# EAGLE design explorator_mainboard_v2_58mm_1_1 (EAGLE 9.6.2)
CNAME: Parrot Teensy Board; CREVISION: 1.0; DESIGNER: Nathan Villicana-Shaw

## Sheet 1 of 2
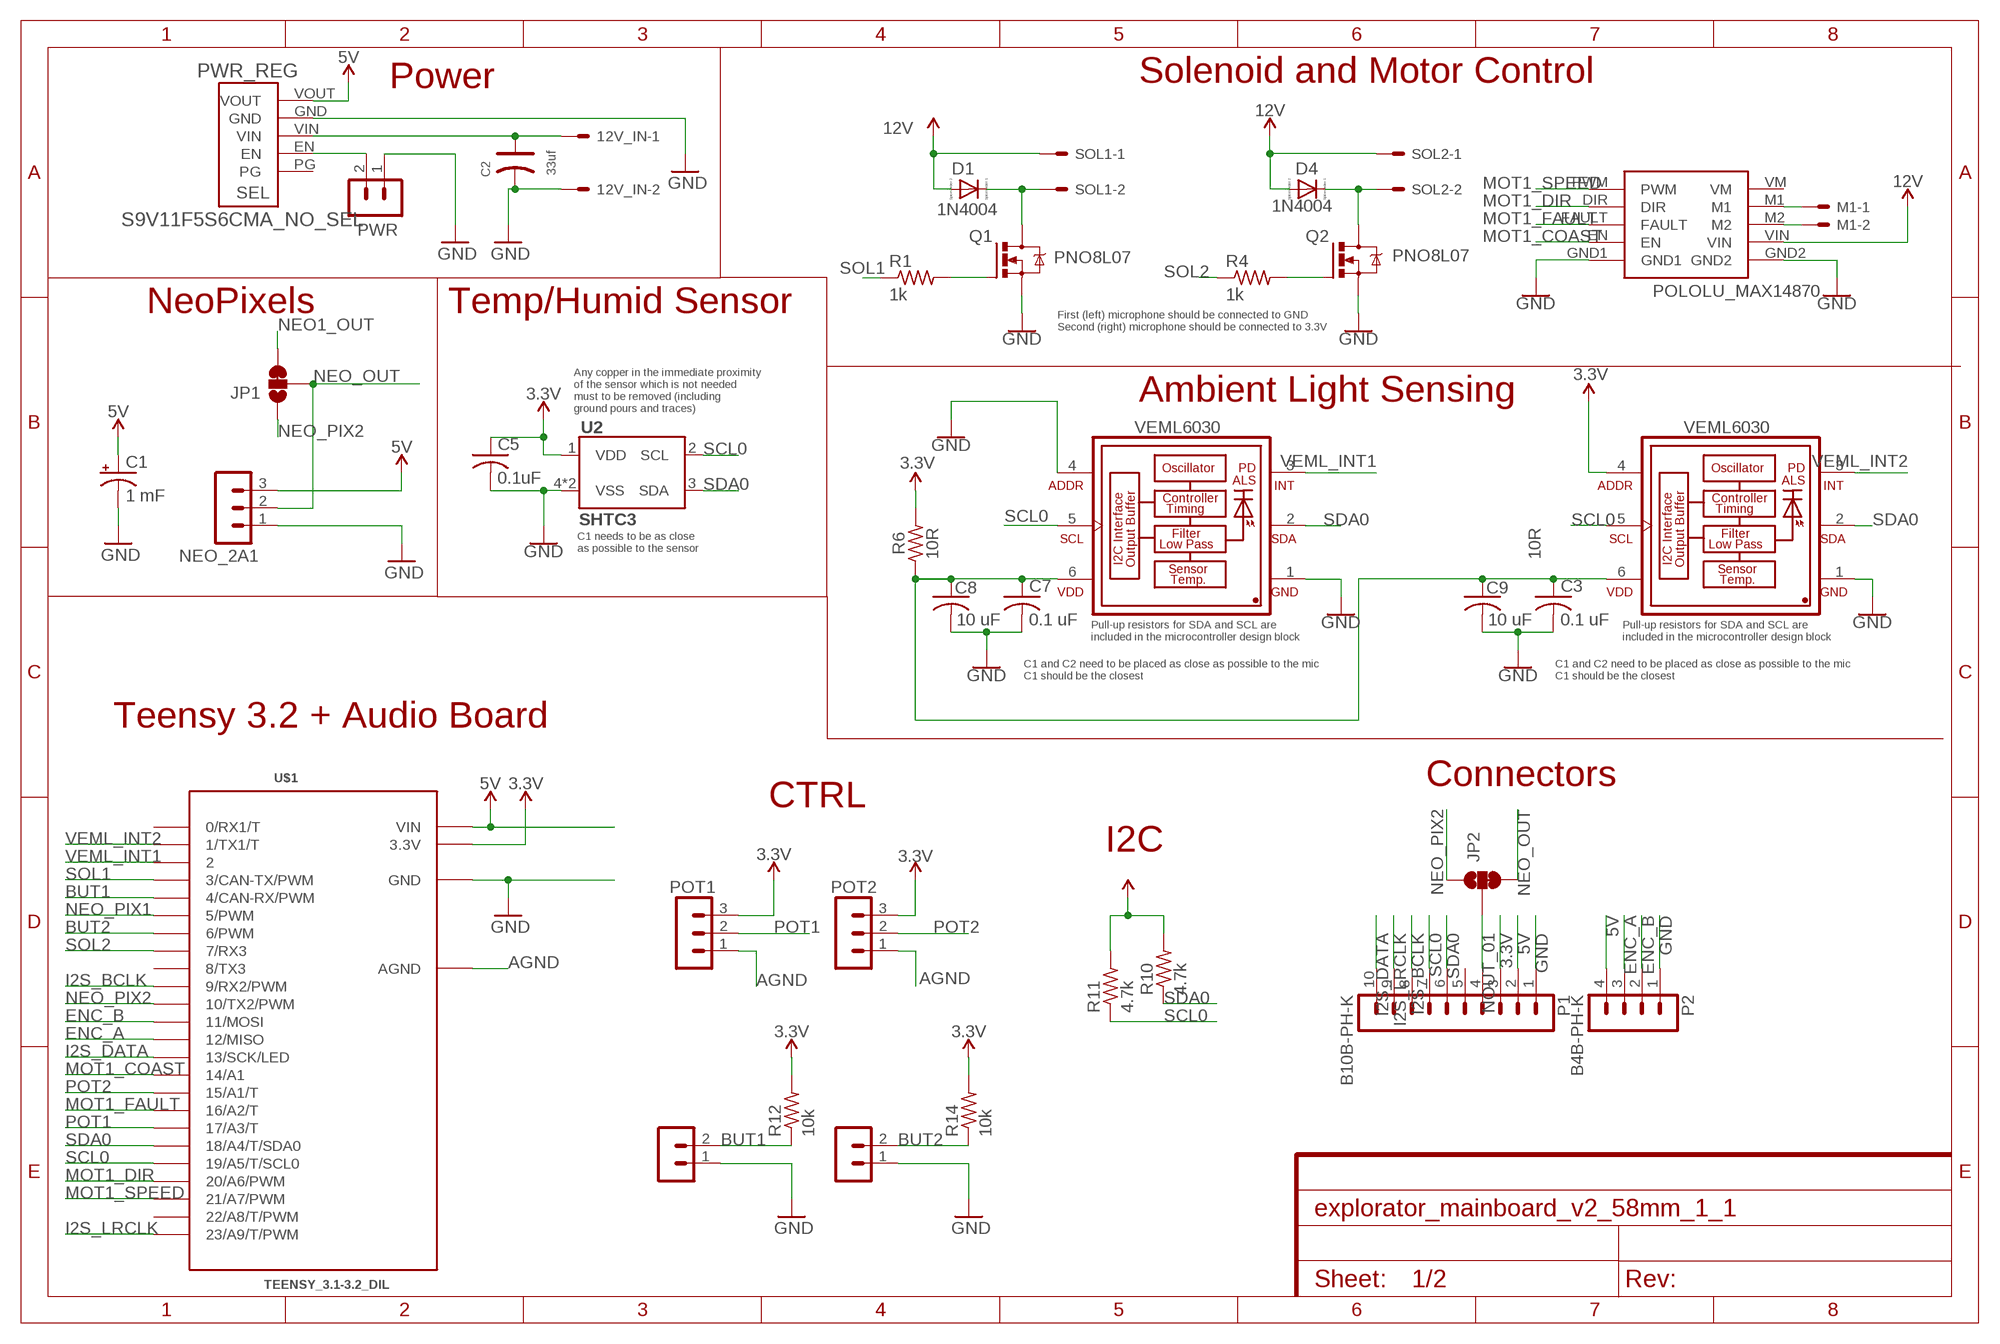
[diagram p0: schematic, sheet 1]

### Parts
12V_IN  5566-2  [5566-2]
BUT1  B2B-PH-K  [B2B-PH-K]
BUT2  B2B-PH-K  [B2B-PH-K]
C1  1 mF  CPOL-USUD-10X10  [UD-10X10_NICHICON]
C2  33uf  DIP-ALUMINUM-47UF-16V(D5-H7MM)  [PC-D5.3MM]
C3  0.1 uF  C-USC0805  [C0805]
C5  0.1uF  C-USC0805  [C0805]
C7  0.1 uF  C-USC0805  [C0805]
C8  10 uF  C-USC0805  [C0805]
C9  10 uF  C-USC0805  [C0805]
D1  1N4004  DIODE_E-DO35-7  [DIODE_DO35-7]
D4  1N4004  DIODE_E-DO35-7  [DIODE_DO35-7]
JP1  JUMPER-SMT_3_1-NC_TRACE_SILK  [SMT-JUMPER_3_1-NC_TRACE_SILK]
JP2  JUMPER-SMT_3_1-NC_TRACE_SILK  [SMT-JUMPER_3_1-NC_TRACE_SILK]
M1  5566-2  [5566-2]
MOT1  POLOLU_MAX14870  [POLOLU_MAX14870]
NEO_2A1  B3B-PH-K  [B3B-PH-K]
P1  B10B-PH-K  [B10B-PH-K]
P2  B4B-PH-K  [B4B-PH-K]
POT1  B3B-PH-K  [B3B-PH-K]
POT2  B3B-PH-K  [B3B-PH-K]
PWR  B2B-PH-K  [B2B-PH-K]
PWR_REG  S9V11F5S6CMA_NO_SEL  [S9V11F3S5CMA_NO_SEL]
Q1  PNO8L07  IRF540  [TO220BV]
Q2  PNO8L07  IRF540  [TO220BV]
R1  1k  R-US_R0805  [R0805]
R4  1k  R-US_R0805  [R0805]
R6  10 R  R-US_R0805  [R0805]
R10  4.7k  R-US_R0805  [R0805]
R11  4.7k  R-US_R0805  [R0805]
R12  10k  R-US_R0805  [R0805]
R14  10k  R-US_R0805  [R0805]
SOL1  5566-2  [5566-2]
SOL2  5566-2  [5566-2]
U2  SHTC3  [SHTC3]
U$1  TEENSY_3.1-3.2_DIL  [TEENSY_3.0-3.2&LC_DIL]
VMEL1  VEML6030  VEML6030-GS15  [VISHAY_VEML6030_2X2X0.87]
VMEL2  VEML6030  VEML6030-GS15  [VISHAY_VEML6030_2X2X0.87]

### Nets
3.3V [3.3V]: C5.1 P1.3 POT1.3 POT2.3 R6.2 R10.2 R11.2 R12.2 R14.2 U2.1(VDD) U$1.3.3V VMEL2.4(ADDR)
5V: C1.+ NEO_2A1.3 P1.2 P2.4 PWR_REG.VOUT U$1.VIN ; also sheet 2
12V [12V_IN]: 12V_IN.1 C2.+ D1.A(C) D4.A(C) MOT1.VIN PWR_REG.VIN SOL1.1 SOL2.1
AGND: POT1.1 POT2.1 U$1.AGND
BUT1: BUT1.2 R12.1 U$1.4(4/CAN-RX/PWM)
BUT2: BUT2.2 R14.1 U$1.6(6/PWM)
ENC_A: P2.3 U$1.12(12/MISO)
ENC_B: P2.2 U$1.11(11/MOSI)
GND: 12V_IN.2 BUT1.1 BUT2.1 C1.- C2.- C3.2 C5.2 C7.2 C8.2 C9.2 MOT1.GND1 MOT1.GND2 NEO_2A1.1 P1.1 P2.1 PWR.1 PWR_REG.GND Q1.S Q2.S U2.4(VSS) U2.5(VSS) U$1.GND VMEL1.1(GND) VMEL1.4(ADDR) VMEL2.1(GND) ; also sheet 2
I2S_BCLK: P1.8 U$1.9(9/RX2/PWM)
I2S_DATA: P1.10 U$1.13(13/SCK/LED)
I2S_LRCLK: P1.9 U$1.23/A9(23/A9/T/PWM)
MOT1_COAST: MOT1.EN U$1.14/A0(14/A1)
MOT1_DIR: MOT1.DIR U$1.20/A6(20/A6/PWM)
MOT1_FAULT: MOT1.FAULT U$1.16/A2(16/A2/T)
MOT1_SPEED: MOT1.PWM U$1.21/A7(21/A7/PWM)
N$1: M1.2 MOT1.M2
N$2: M1.1 MOT1.M1
N$7: C3.1 C7.1 C8.1 C9.1 R6.1 VMEL1.6(VDD) VMEL2.6(VDD)
N$10: PWR.2 PWR_REG.EN
N$13: Q2.G R4.2
N$14: D4.C(A) Q2.D SOL2.2
N$24: Q1.G R1.2
N$25: D1.C(A) Q1.D SOL1.2
NEO1_OUT: JP1.3 ; also sheet 2
NEO_OUT: JP1.2 JP2.3 NEO_2A1.2
NEO_PIX1: U$1.5(5/PWM) ; also sheet 2
NEO_PIX2: JP1.1 JP2.1 U$1.10(10/TX2/PWM)
NOUT_01: JP2.2 P1.4
POT1: POT1.2 U$1.17/A3(17/A3/T)
POT2: POT2.2 U$1.15/A1(15/A1/T)
SCL0: P1.7 R11.1 U2.2(SCL) U$1.19/A5(19/A5/T/SCL0) VMEL1.5(SCL) VMEL2.5(SCL)
SDA0: P1.6 R10.1 U2.3(SDA) U$1.18/A4(18/A4/T/SDA0) VMEL1.2(SDA) VMEL2.2(SDA)
SOL1: R1.1 U$1.3(3/CAN-TX/PWM)
SOL2: R4.1 U$1.7(7/RX3)
VEML_INT1: U$1.2 VMEL1.3(INT)
VEML_INT2: U$1.1(1/TX1/T) VMEL2.3(INT)
Unconnected: MOT1.VM P1.5 PWR_REG.PG U$1.0(0/RX1/T) U$1.8(8/TX3) U$1.22/A8(22/A8/T/PWM)

### Notes on the sheet
- Power | Solenoid and Motor Control
- NeoPixels | Temp/Humid Sensor
- First (left) microphone should be connected to GND
  Second (right) microphone should be connected to 3.3V
- Ambient Light Sensing
- Any copper in the immediate proximity 
  of the sensor which is not needed
  must to be removed (including 
  ground pours and traces)
- C1 needs to be as close
  as possible to the sensor
- 10R | 10R
- Pull-up resistors for SDA and SCL are 
  included in the microcontroller design block
- Pull-up resistors for SDA and SCL are 
  included in the microcontroller design block
- C1 and C2 need to be placed as close as possible to the mic
  C1 should be the closest
- C1 and C2 need to be placed as close as possible to the mic
  C1 should be the closest
- Teensy 3.2 + Audio Board
- Connectors
- CTRL
- I2C

## Sheet 2 of 2
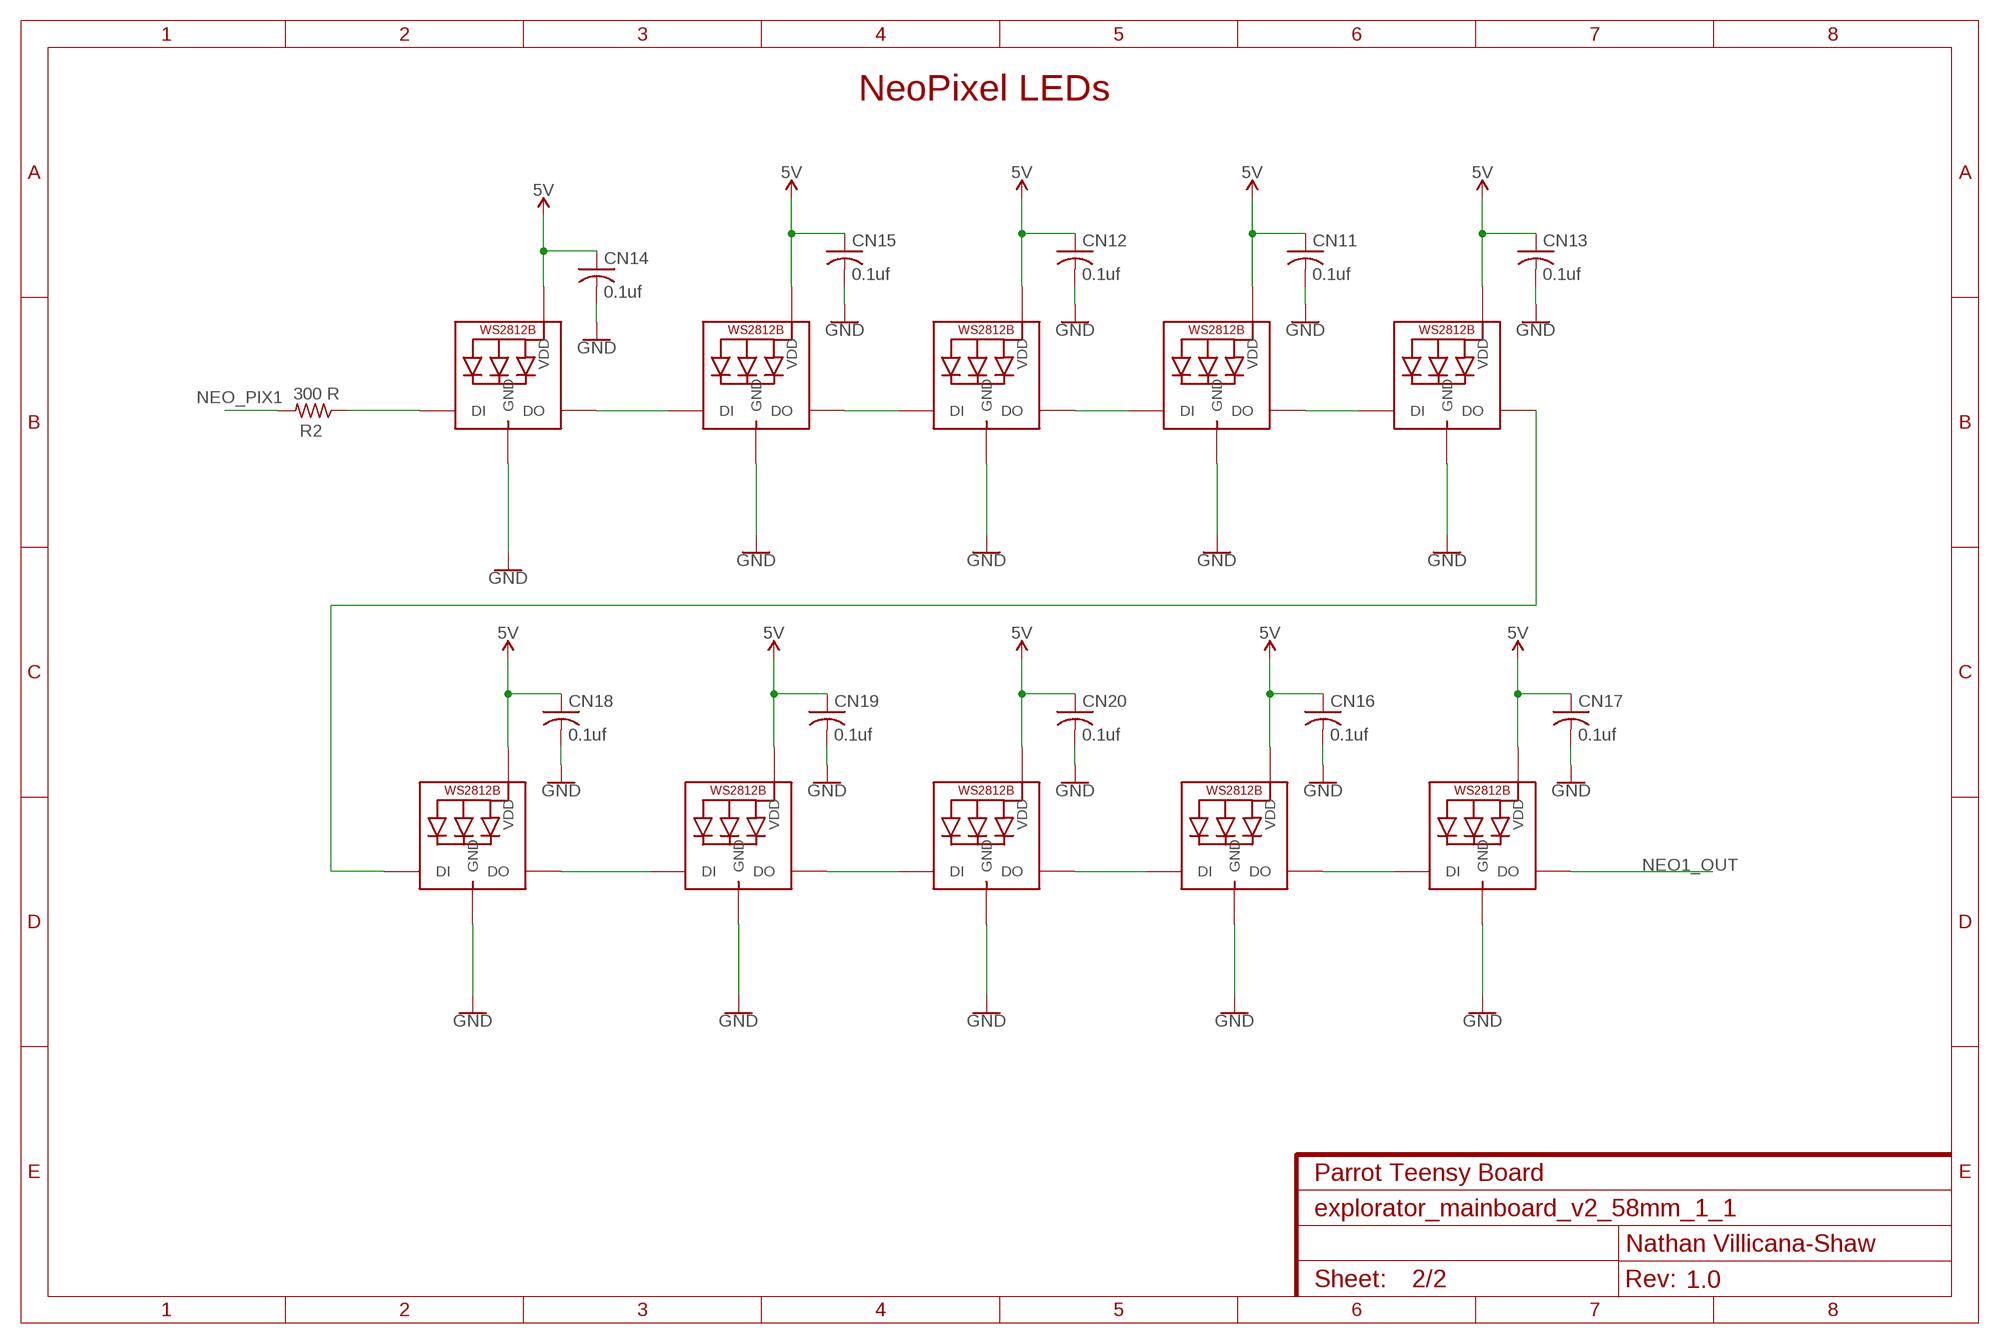
[diagram p1: schematic, sheet 2]

### Parts
CN11  0.1uf  C-USC0805K  [C0805K]
CN12  0.1uf  C-USC0805K  [C0805K]
CN13  0.1uf  C-USC0805K  [C0805K]
CN14  0.1uf  C-USC0805K  [C0805K]
CN15  0.1uf  C-USC0805K  [C0805K]
CN16  0.1uf  C-USC0805K  [C0805K]
CN17  0.1uf  C-USC0805K  [C0805K]
CN18  0.1uf  C-USC0805K  [C0805K]
CN19  0.1uf  C-USC0805K  [C0805K]
CN20  0.1uf  C-USC0805K  [C0805K]
NEO11  WS2812B5050  [WS2812B]
NEO12  WS2812B5050  [WS2812B]
NEO13  WS2812B5050  [WS2812B]
NEO14  WS2812B5050  [WS2812B]
NEO15  WS2812B5050  [WS2812B]
NEO16  WS2812B5050  [WS2812B]
NEO17  WS2812B5050  [WS2812B]
NEO18  WS2812B5050  [WS2812B]
NEO19  WS2812B5050  [WS2812B]
NEO20  WS2812B5050  [WS2812B]
R2  300 R  R-US_R0805  [R0805]

### Nets
5V: CN11.1 CN12.1 CN13.1 CN14.1 CN15.1 CN16.1 CN17.1 CN18.1 CN19.1 CN20.1 NEO11.1-VDD(VDD) NEO12.1-VDD(VDD) NEO13.1-VDD(VDD) NEO14.1-VDD(VDD) NEO15.1-VDD(VDD) NEO16.1-VDD(VDD) NEO17.1-VDD(VDD) NEO18.1-VDD(VDD) NEO19.1-VDD(VDD) NEO20.1-VDD(VDD) ; also sheet 1
GND: CN11.2 CN12.2 CN13.2 CN14.2 CN15.2 CN16.2 CN17.2 CN18.2 CN19.2 CN20.2 NEO11.3-GND(GND) NEO12.3-GND(GND) NEO13.3-GND(GND) NEO14.3-GND(GND) NEO15.3-GND(GND) NEO16.3-GND(GND) NEO17.3-GND(GND) NEO18.3-GND(GND) NEO19.3-GND(GND) NEO20.3-GND(GND) ; also sheet 1
N$17: NEO14.2-DOUT(DO) NEO15.4-DIN(DI)
N$18: NEO12.4-DIN(DI) NEO15.2-DOUT(DO)
N$19: NEO11.4-DIN(DI) NEO12.2-DOUT(DO)
N$20: NEO11.2-DOUT(DO) NEO13.4-DIN(DI)
N$21: NEO13.2-DOUT(DO) NEO18.4-DIN(DI)
N$22: NEO14.4-DIN(DI) R2.1
N$23: NEO18.2-DOUT(DO) NEO19.4-DIN(DI)
N$26: NEO19.2-DOUT(DO) NEO20.4-DIN(DI)
N$27: NEO16.4-DIN(DI) NEO20.2-DOUT(DO)
N$28: NEO16.2-DOUT(DO) NEO17.4-DIN(DI)
NEO1_OUT: NEO17.2-DOUT(DO) ; also sheet 1
NEO_PIX1: R2.2 ; also sheet 1

### Notes on the sheet
- NeoPixel LEDs

## Library data of the parts
12V_IN M1 SOL1 SOL2 = con-molex:5566-2: Mini FIT connector 2 pol Source: http://www.molex.com; MF: MOLEX; OC_FARNELL: 1822072; OC_NEWARK: unknown
BUT1 BUT2 PWR = con-jst-ph:B2B-PH-K: HEADER
C1 = rcl:CPOL-US: POLARIZED CAPACITOR, American symbol; SPICEPREFIX: C
C2 = Seeed-Capacitor:DIP-ALUMINUM-47UF-16V(D5-H7MM): 302030033; MPN: KS 100uF/16V; VALUE: 100uf
C3 C5 C7-C9 = rcl:C-US: CAPACITOR, American symbol; SPICEPREFIX: C
CN11-CN20 = resistor:C-US: CAPACITOR, American symbol
D1 D4 = eagle-ltspice:DIODE_E-: Schottky Diode; SPICEMODEL: diode; SPICEPREFIX: D
JP1 JP2 = SparkFun-Jumpers:JUMPER-SMT_3_1-NC_TRACE: Normally closed trace jumper (1 of 2 connections) This jumper has a trace between two pads so it's normally closed (NC). The other connection is normally open (NO). Use a razor knife to open the connection. For best results follow the IPC guidelines for cutting traces: Cutout at least 0.063 mm (0.005 in). Remove all loose material to clean up the cut area. Seal the cut with an approved epoxy. Reapply solder to reclose the connection, or to close the NO connection.
MOT1 = nathans-custom-parts:POLOLU_MAX14870
NEO11-NEO20 = nathans-custom-parts:WS2812B
NEO_2A1 POT1 POT2 = con-jst-ph:B3B-PH-K: HEADER
P1 = con-jst-ph:B10B-PH-K: HEADER
P2 = con-jst-ph:B4B-PH-K: HEADER
PWR_REG = nathans-custom-parts:S9V11F5S6CMA_NO_SEL
Q1 Q2 = nathans-custom-parts:IRF540: HEXFET Power MOSFET
R1 R4 R10-R12 R14 = rcl:R-US_: RESISTOR, American symbol; SPICEPREFIX: R
R2 R6 = audio amplifier example:R-US_: RESISTOR, American symbol
U2 = SHTC3:SHTC3
U$1 = Teensy_3_and_LC_Series_Boards_v1.4:TEENSY_3.1-3.2_DIL: Teensy 3.1 or 3.2 in a DIL Layout.
VMEL1 VMEL2 = VEML6030-GS15:VEML6030-GS15: VEML6030 High Accuracy Ambient Light Sensor with I2C Interface: VEML6030 is a high accuracy ambient light digital 16-bit resolution sensor in a miniature transparent 2 mm x 2 mm package. It includes a high sensitive photodiode, a low noise amplifier, a 16-bit A/D converter and supports an easy to use I2C bus communication interface and additional interrupt feature. The ambient light result is as digital value available. Device Model created 15.06.2016 by Johannes Kolb - Vishay Semiconductor GmbH; AVAILABILITY: Unavailable; DESCRIPTION: Optical Sensor Ambient 550nm I²C 6-SMD, No Lead; MF: Vishay Semiconductor; MP: VEML6030-GS15; PACKAGE: SMD-6 Vishay; PRICE: None

## Net classes
0 default: width 0.203 mm, drill 0.254 mm, clearance 0.178 mm
1 12V_IN: width 1.016 mm, drill 0.381 mm, clearance 0.203 mm
2 3.3V: width 0.305 mm, drill 0.305 mm, clearance 0.203 mm
3 5V: width 0.635 mm, drill 0.305 mm, clearance 0.203 mm

## Board
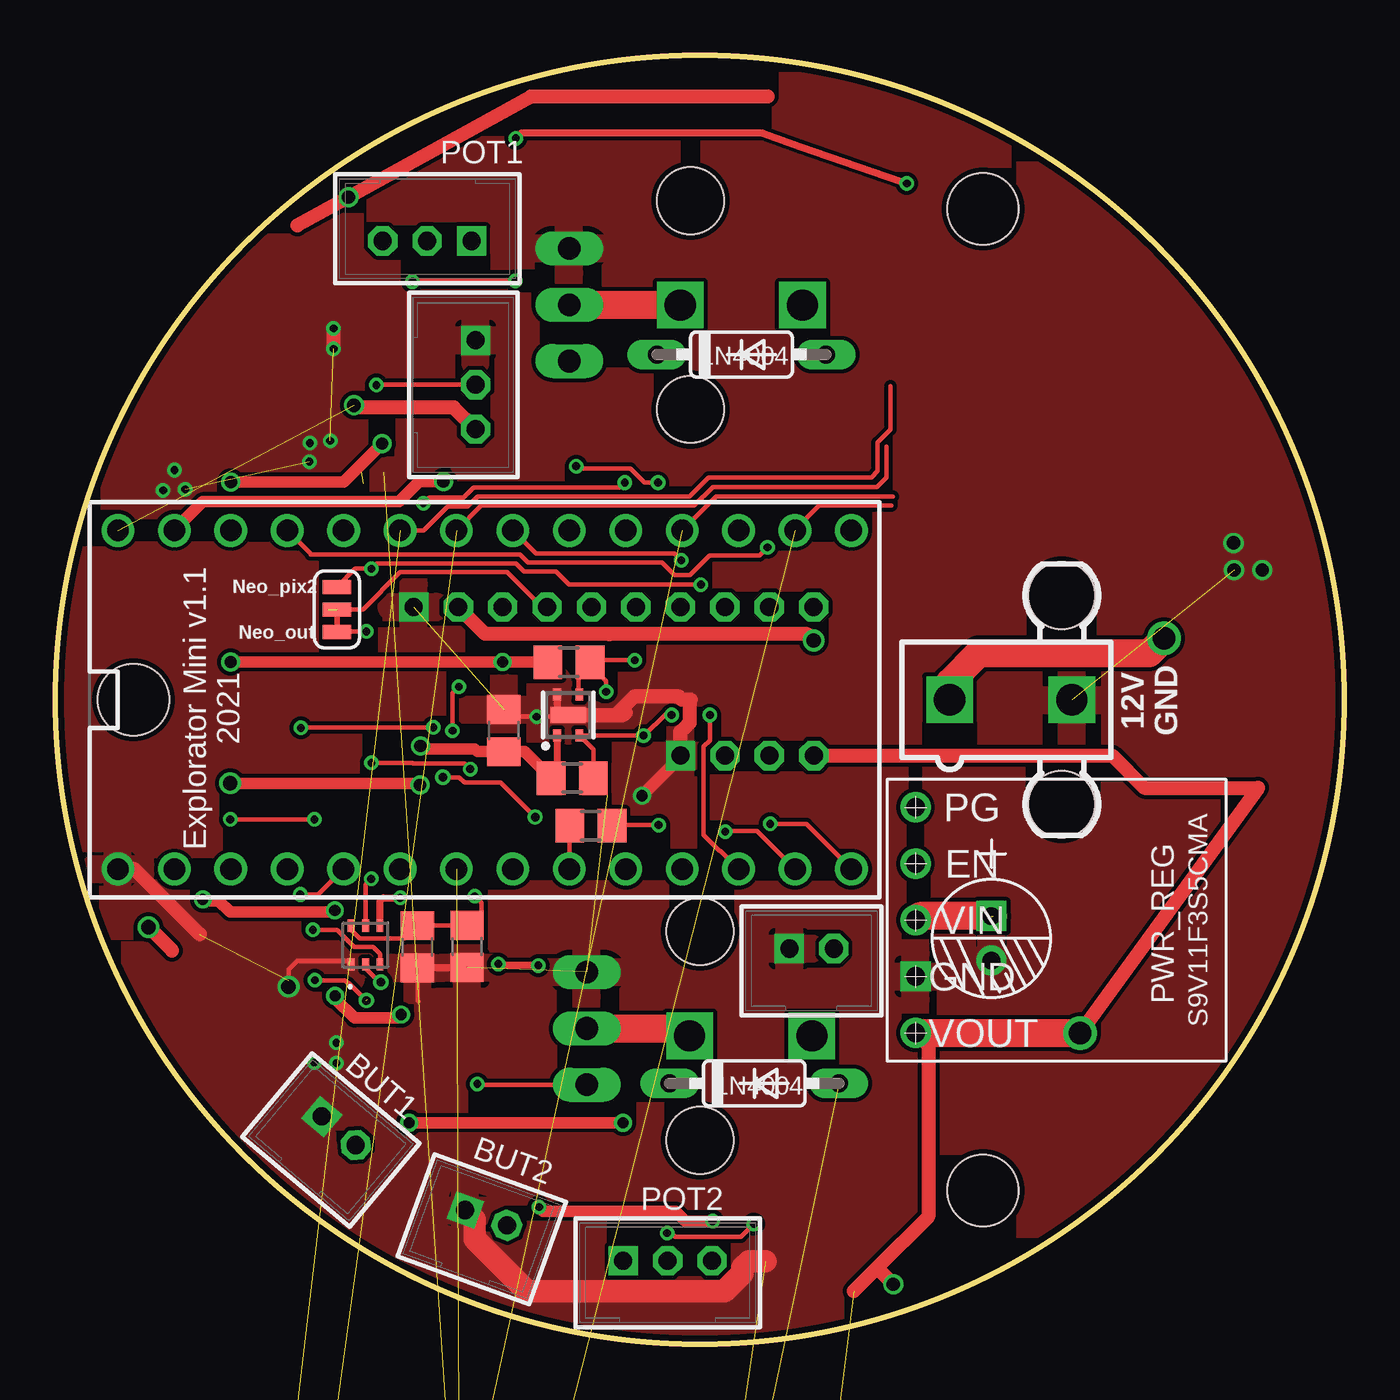
[diagram p2: board, top side]
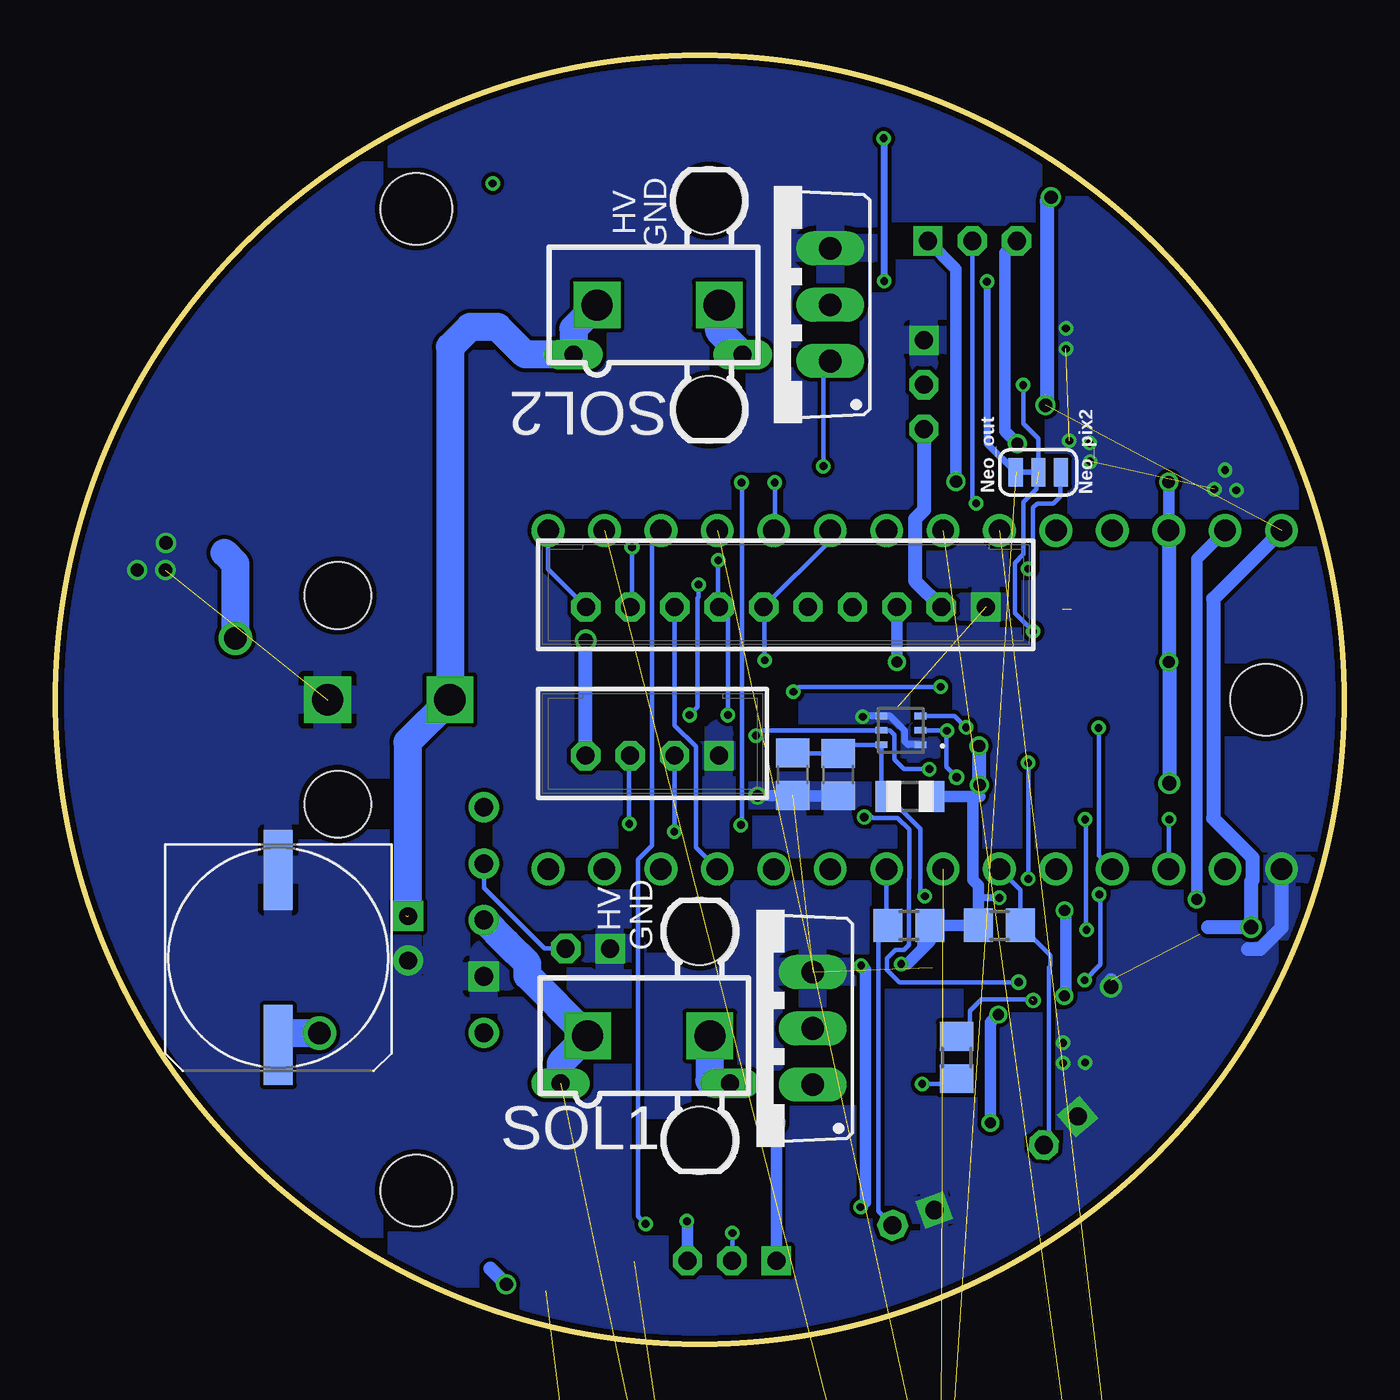
[diagram p3: board, bottom side, seen from below]

Size 58 x 58 mm. Coordinates in mm from the lower left corner, seen from the top.
Outline: circle at 29,29 radius 29
Copper layers (1*16): Top 0.035mm / dielectric 1.5mm / Bottom 0.035mm
Design rules "SeeedStudio_2layer_DRU_no_angle_20140221": minimum track width 6mil, minimum drill 12mil, track to track 6mil, track to pad 6mil, pad to pad 6mil, via to via 6mil, smd to smd 0mil, copper to edge 10mil, drill to drill 10mil, minimum pad ring 10mil, minimum via ring 6mil, stop-mask expansion 2mil, vias tented up to drill 100mil, thermal gap 10mil
Holes 3.2 mm at 41.75,6.9 3.5,29 41.75,51.1

### Footprints (pad centres in the part's own frame; a part is rotated, then mirrored left to right if it is on the bottom)
5566-2 = drill 1.4 square: 1 0,-2.75; 2 0,2.75 | hole 3: 4.7,2.29; -4.7,2.29
B2B-PH-K = drill 0.813 square: 1 -1,0 | drill 0.813 octagon: 2 1,0
UD-10X10_NICHICON = smd 3.6 x 1.3: + 3.925,0; - -3.95,0
PC-D5.3MM = drill 0.8 pad 1.35 square: + -1,0 | drill 0.8 pad 1.35: - 1,0
C0805 = smd 1.3 x 1.5: 1 -0.95,0; 2 0.95,0
C0805K = smd 1.3 x 1.6: 1 -1,0; 2 1,0
DIODE_DO35-7 = drill 0.813 long: A 3.81,0; C -3.81,0
SMT-JUMPER_3_1-NC_TRACE_SILK = smd 0.635 x 1.27: 1 -1.016,0; 2 0,0; 3 1.016,0
POLOLU_MAX14870 = drill 0.85: DIR -6.35,2.54; EN -6.35,-2.54; FAULT -6.35,0; M1 6.35,2.54; M2 6.35,0; PWM -6.35,5.08; VIN 6.35,-2.54; VM 6.35,5.08 | drill 0.85 square: GND1 -6.35,-5.08; GND2 6.35,-5.08
WS2812B = smd 1.5 x 0.9: 1-VDD 2.45,-1.65; 2-DOUT 2.45,1.65; 3-GND -2.45,1.65; 4-DIN -2.45,-1.65
B3B-PH-K = drill 0.813 square: 1 -2,0 | drill 0.813 octagon: 2 0,0; 3 2,0
B10B-PH-K = drill 0.813 square: 1 -9,0 | drill 0.813 octagon: 2 -7,0; 3 -5,0; 4 -3,0; 5 -1,0; 6 1,0; 7 3,0; 8 5,0; 9 7,0; 10 9,0
B4B-PH-K = drill 0.813 square: 1 -3,0 | drill 0.813 octagon: 2 -1,0; 3 1,0; 4 3,0
S9V11F3S5CMA_NO_SEL = drill 0.85: EN -2.54,-6.35; PG -5.08,-6.35; VIN 0,-6.35; VOUT 5.08,-6.35 | drill 0.85 square: GND 2.54,-6.35
TO220BV = drill 1.016 long: D 0,-2.54; G -2.54,-2.54; S 2.54,-2.54
R0805 = smd 1.3 x 1.5: 1 -0.95,0; 2 0.95,0
R0805' = smd 1.1 x 1.4: 1 -1,0; 2 1,0
SHTC3 = smd 0.55 x 0.35: 1 -0.925,0.5; 2 -0.925,-0.5; 3 0.925,-0.5; 4 0.925,0.5 | smd 0.7 x 1.6: 5 0,0
TEENSY_3.0-3.2&LC_DIL = drill 0.965: 0 -7.62,13.97; 1 -7.62,11.43; 2 -7.62,8.89; 3 -7.62,6.35; 3.3V 7.62,11.43; 4 -7.62,3.81; 5 -7.62,1.27; 6 -7.62,-1.27; 7 -7.62,-3.81; 8 -7.62,-6.35; 9 -7.62,-8.89; 10 -7.62,-11.43; 11 -7.62,-13.97; 12 -7.62,-16.51; 13 7.62,-16.51; 14/A0 7.62,-13.97; 15/A1 7.62,-11.43; 16/A2 7.62,-8.89; 17/A3 7.62,-6.35; 18/A4 7.62,-3.81; 19/A5 7.62,-1.27; 20/A6 7.62,1.27; 21/A7 7.62,3.81; 22/A8 7.62,6.35; 23/A9 7.62,8.89; AGND 7.62,13.97; GND -7.62,16.51; VIN 7.62,16.51
VISHAY_VEML6030_2X2X0.87 = smd 0.55 x 0.3: 1 -0.875,0.65; 2 -0.875,0; 3 -0.875,-0.65; 4 0.875,-0.65; 5 0.875,0; 6 0.875,0.65

### Placement (x,y rotation side)
12V_IN  43,29 270 top
BUT1  12.75,9.6 320 top
BUT2  19.38,5.68 340 top
C1  47.97,17.39 270 bottom
C2  42.13,18.26 270 top
C3  16.29,17.88 270 top
C5  20.18,27.61 90 top
C7  22.77,25.63 270 bottom
C8  24.82,25.65 270 bottom
C9  18.52,17.9 270 top
CN11  1.19,-72.8 0 top  (outside the outline)
CN12  23.56,-62.21 0 top  (outside the outline)
CN13  28.34,-62.21 0 top  (outside the outline)
CN14  1.19,-68.05 0 top  (outside the outline)
CN15  5.96,-68.05 0 top  (outside the outline)
CN16  10.74,-68.05 0 top  (outside the outline)
CN17  15.51,-68.05 0 top  (outside the outline)
CN18  20.29,-68.05 0 top  (outside the outline)
CN19  25.06,-68.05 0 top  (outside the outline)
CN20  29.84,-68.05 0 top  (outside the outline)
D1  31.45,11.73 0 top
D4  30.88,44.54 0 top
JP1  13.76,39.24 180 bottom
JP2  12.67,33.06 270 top
M1  5.73,-99.12 0 top  (outside the outline)
MOT1  8.3,-83.78 0 top  (outside the outline)
NEO11  2.74,-51.47 0 top  (outside the outline)
NEO12  10.66,-51.47 0 top  (outside the outline)
NEO13  18.59,-51.47 0 top  (outside the outline)
NEO14  26.51,-51.47 0 top  (outside the outline)
NEO15  2.74,-57.31 0 top  (outside the outline)
NEO16  10.66,-57.31 0 top  (outside the outline)
NEO17  18.59,-57.31 0 top  (outside the outline)
NEO18  26.51,-57.31 0 top  (outside the outline)
NEO19  2.74,-63.15 0 top  (outside the outline)
NEO20  10.66,-63.15 0 top  (outside the outline)
NEO_2A1  18.91,43.18 270 top
P1  25.13,33.18 180 bottom
P2  31.13,26.49 180 bottom
POT1  16.73,49.66 180 top
POT2  27.55,3.75 0 top
PWR  34.03,17.8 0 top
PWR_REG  45.07,19.08 270 top
Q1  26.45,14.21 90 bottom
Q2  25.67,46.78 90 bottom
R1  17.44,12.89 270 bottom
R2  300 R  [R0805']  17.34,-62.72 0 top  (outside the outline)
R4  24.1,23.33 0 top
R6  10 R  [R0805']  19.53,24.65 0 bottom
R10  23.11,30.69 180 top
R11  23.26,25.47 180 top
R12  15.51,18.85 180 bottom
R14  19.58,18.84 0 bottom
SOL1  31.3,13.87 270 bottom
SOL2  30.87,46.77 270 bottom
U2  23.08,28.31 90 top
U$1  19.32,29 90 top
VMEL1  19.95,27.62 180 bottom
VMEL2  13.96,17.96 90 top

### Tracks (layer width: path | path; a pad name or v marks a point on that pad's centre or on a via)
3.3V  (via drill 0.35, 0.5, 0.55, 0.65)
  Top 0.305: U2.1 22.58,25.75 R11.2 | v21.76,6.16 21.79,6.14 | v19.93,17.11 20,17.04 v21.74,17.04 | VMEL2.4 14.61,19.94 14.75,20.09 v15.51,20.09
  Top 0.508: v14.7,40.53 12.97,38.8 v7.89,38.8 | v16.4,25.16 16.32,25.24 v7.87,25.24 v7.86,25.24 | R11.2 21.12,26.66 C5.1 18.99,26.66 18.87,26.78 16.56,26.78 v16.43,26.92 | R10.2 20.11,30.69 | 20.11,30.69 v7.9,30.69 v7.89,30.7 | v20.13,30.71 20.11,30.69 | v29.58,5.53 28.37,5.53 27.92,5.98 21.95,5.98 21.79,6.14
  Bottom 0.305: 19.07,17.69 19.07,18.41 18.75,18.72 R14.2 | v15.51,20.09 16.41,20.09 16.46,20.13
  Bottom 0.508: POT1.3 15.26,49.13 15.26,41.09 v14.7,40.53 | v7.89,38.8 U$1.3.3V | R6.2 16.76,24.65 | 16.76,24.65 16.39,24.65 16.43,24.68 v16.43,26.92 | P1.3 v20.13,30.71 | 16.76,24.65 16.7,24.59 16.7,20.89 16.46,20.65 16.46,20.13 R12.2 R14.2 18.75,18.72 | R14.2 18.63,18.13 19.07,17.69 19.66,17.11 v19.93,17.11 | v21.74,17.04 21.55,16.85 21.55,6.38 v21.76,6.16 | POT2.3 29.55,5.5 v29.58,5.53
  Bottom 0.635: U$1.3.3V v7.89,30.7 7.86,30.68 v7.86,25.24 | v16.4,25.16 16.4,26.89 v16.43,26.92
5V  (via drill 0.6, 0.65, 1)  (21 unrouted)
  Top 0.635: P2.4 47.57,26.48 49.02,25.04 54.14,25.04 v46.12,13.99 | v34.13,31.67 33.84,31.95 24.93,31.95 24.92,31.96 19.34,31.96 P1.2 | 32.06,56.15 21.4,56.15 v13.19,51.63 10.89,50.36 | NEO_2A1.3 17.93,42.16 13.54,42.16 v13.44,42.26 | PWR_REG.VOUT 39.29,13.43 39.29,5.73 36.96,3.41 | 36.96,3.41 35.94,2.38 | v4.18,18.76 5.24,17.71 | v37.71,2.69 36.99,3.41 36.96,3.41
  Top 1.27: PWR_REG.VOUT 46.11,14 v46.12,13.99
  Bottom 0.635: NEO_2A1.3 18.91,37.54 19.3,37.14 19.3,34.35 P1.2 | P2.4 v34.13,31.66 v34.13,31.67 | v13.44,42.26 13.38,42.31 13.38,51.43 v13.19,51.63 | 6.11,18.76 v4.18,18.76 4.18,20.8 4.12,20.87 4.12,21.89 5.88,23.66 5.88,33.54 U$1.VIN | 38.43,3.4 v37.71,2.69
  Bottom 1.27: v46.12,13.99 47.8,13.99 47.87,14.06 47.97,13.97 C1.+
12V  (via drill 1)  (3 unrouted)
  Top 1.27: 42.21,19.26 38.9,19.26 PWR_REG.VIN 38.67,19.08 | v49.9,31.77 49.22,31.08 41.55,31.08 40.25,29.79 12V_IN.1
  Bottom 1.016: 42.03,19.26 C2.+
  Bottom 1.27: 42.16,19.23 42.16,27.09 12V_IN.1 40.25,44.88 39.35,45.78 38.09,45.78 36.86,44.54 D4.A 34.69,45.7 SOL2.1 | 50.4,35.62 50.39,35.62 49.9,35.13 v49.9,31.77 | D1.A 35.26,12.65 SOL1.1 36.76,16.58 36.76,17.12 37.69,18.06 37.7,18.06 PWR_REG.VIN
AGND  (via drill 0.5, 0.55)
  Top 0.508: v17.46,38.83 16.37,38.83 15.46,37.91 6.62,37.91 5.35,36.64 U$1.AGND | v25.55,9.95 v15.92,9.95 | v15.56,14.83 15.41,14.67 13.46,14.67 12.59,15.54 v12.59,15.66 | v12.57,19.51 12.51,19.45 7.85,19.45 7.35,19.95 6.69,19.95 v6.63,20.01
  Bottom 0.508: POT1.1 17.46,48.39 v17.46,38.83 | POT2.1 v25.55,9.94 v25.55,9.95 | v15.92,9.95 15.92,14.47 v15.56,14.83 | v12.59,15.66 12.51,15.74 12.51,19.45 v12.57,19.51 | v6.63,20.01 6.63,35.34 U$1.AGND
BUT1
  Bottom 0.203: BUT1.2 13.29,9.18 13.29,16.96 13.21,17.04 13.21,17.49 R12.1 14.56,20.44 U$1.4
BUT2
  Bottom 0.203: R14.1 20.59,18.79 | BUT2.2 20.95,5.98 20.95,18.42 20.6,18.77 20.59,18.79 | U$1.6 20.59,18.79
ENC_A  (via drill 0.35)
  Top 0.203: U$1.12 33.8,23.41 v32.17,23.41
  Bottom 0.203: v32.17,23.41 32.17,26.44 P2.3
ENC_B  (via drill 0.35)
  Top 0.203: v30.14,23.06 30.18,23.09 31.57,23.09 U$1.11
  Bottom 0.203: P2.2 30.13,23.07 v30.14,23.06
GND  (via drill 0.35, 0.5, 0.6, 0.65)  (29 unrouted)
  Top 0.203: 22.58,28.3 22.52,28.24 v21.66,28.24 20.51,28.24 C5.2 | 16.35,15.41 16.29,15.47 C3.2 16.29,16.12 | VMEL2.1 13.14,17.25 10.87,17.25 10.49,16.87 v10.49,16.09
  Top 0.305: C9.2 18.51,16.93 C3.2 15.9,16.93 | U2.4 22.58,28.3 22.6,28.31 U2.5
  Top 0.508: v26.39,24.68 28.13,26.42 P2.1
  Top 0.635: U2.5 25.21,28.31 | 25.21,28.31 25.57,28.31 25.67,28.42 | P2.1 28.13,27.55 28.55,27.97 28.55,28.96 28.59,29 28.21,29 28.07,29.14 26.04,29.14 25.21,28.31 | v12.52,44.8 v12.52,45.71 | U$1.GND 3.55,21.38 6.49,18.44
  Top 1.016: 31.95,3.73 31.21,3.73 30.93,3.44 30.93,3.18 30.12,2.38 21.23,2.38 18.86,4.74 18.86,5.6 BUT2.1
  Bottom 0.305: VMEL1.1 19.08,26.98 19.62,26.98 19.77,27.13 19.77,27.6 20.44,28.27 VMEL1.4 21.62,28.27 v21.66,28.24
  Bottom 0.508: C7.2 24.8,24.68 C8.2 26.38,24.7 v26.39,24.68
  Bottom 0.635: 4.31,17.78 3.78,17.78 2.81,18.75 U$1.GND | 10.49,16.38 v10.49,16.09
  other vias: 5.35,39.34 4.84,38.42 5.84,38.47 12.64,13.56 12.64,12.64 11.65,12.67 11.42,39.72 11.45,40.56 12.36,40.66 53.05,34.84 54.32,34.84 53.03,36.06
  pour Bottom: 0.12,29.78 arc90 29.7,0.2 arc90 57.88,28.38 arc90 28.3,57.96 arc90
  pour Top: 0.31,30.26 0.31,29.81 arc90 29.7,0.42 31.06,0.42 arc90 57.72,27.08 57.72,30.08 arc90 30.68,57.12 27.16,57.12 arc90
I2S_BCLK
  Bottom 0.203: P1.8 30.13,27.84 29.17,26.88 29.17,22.34 U$1.9
I2S_DATA
  Bottom 0.203: P1.10 35.83,34.88 U$1.13
I2S_LRCLK  (via drill 0.35)
  Top 0.203: v32.05,35.86 31.69,35.5 29.43,35.5 28.55,34.62 27.86,34.62 27.31,35.17 21.27,35.17 20.91,35.53 11.48,35.53 11.48,35.57 U$1.23/A9
  Bottom 0.203: P1.9 32.05,33.26 v32.05,35.86
MOT1_COAST  (1 unrouted)
  Top 0.203: 37.62,37.74 34.36,37.74 33.29,36.67 U$1.14/A0
MOT1_DIR  (1 unrouted)
  Top 0.203: 37.41,40.41 37.41,39.01 36.98,38.58 29.59,38.58 28.75,37.74 19.16,37.74 U$1.20/A6
MOT1_FAULT  (1 unrouted)
  Top 0.203: U$1.16/A2 29.73,38.14 37.69,38.14
MOT1_SPEED  (1 unrouted)
  Top 0.203: 37.59,43.12 37.59,41.16 37,40.57 37,39.29 36.72,39.01 29.39,39.01 28.53,38.14 19,38.14 18.54,37.69 17.64,37.69 16.57,36.62 U$1.21/A7
N$1  (1 unrouted)
N$2  (1 unrouted)
N$7  (via drill 0.35)
  Top 0.203: v18.87,20.16 19.17,19.86 19.17,19.14 18.87,18.85 C9.1 16.3,18.85 C3.1 15.71,18.25 13.7,18.25 13.31,18.64 VMEL2.6
  Bottom 0.203: C8.1 24.8,26.58 C7.1 22.38,26.97 VMEL1.6 20.82,24.94 R6.1 19.07,23.19 19.07,20.36 v18.87,20.16
N$10
  Bottom 0.203: PWR.2 35.98,17.8 38.72,20.53 PWR_REG.EN
N$13  (via drill 0.35)
  Top 0.203: v27.12,38.78 26.52,38.78 25.88,39.41 23.55,39.41 v23.44,39.52 | v27.15,23.36 25.08,23.36 R4.2
  Bottom 0.203: Q2.G 23.44,43.93 v23.44,39.52 | v27.12,38.78 27.1,38.76 27.1,23.41 v27.15,23.36
N$14
  Top 1.27: SOL2.2 Q2.D
  Bottom 1.27: D4.C 28.12,45.6 SOL2.2
N$17  (1 unrouted)
N$18  (1 unrouted)
N$19  (1 unrouted)
N$20  (1 unrouted)
N$21  (1 unrouted)
N$22  (1 unrouted)
N$23  (1 unrouted)
N$24  (via drill 0.35)
  Top 0.203: Q1.G 19.03,11.67 v18.99,11.7
  Bottom 0.203: R1.2 17.72,11.67 17.76,11.7 v18.99,11.7
N$25
  Top 1.27: Q1.D 28.21,14.21 SOL1.2
  Bottom 1.27: SOL1.2 28.57,13.85 28.57,11.86 28.44,11.73 D1.C
N$26  (1 unrouted)
N$27  (1 unrouted)
N$28  (1 unrouted)
NEO1_OUT  (via drill 0.35)  (1 unrouted)
  Top 0.305: v16.07,47.82 20.67,47.82 v20.69,47.85 | v20.72,54.27 20.96,54.51 31.84,54.51 33.53,53.89 38.04,52.34 v38.32,52.24
  Bottom 0.305: JP1.3 16.05,40.51 16.05,47.8 v16.07,47.82 | v20.69,47.85 20.69,54.25 v20.72,54.27
NEO_OUT  (via drill 0.35)  (1 unrouted)
  Top 0.203: NEO_2A1.2 v14.44,43.18 v14.44,43.17 | JP2.3 12.69,32.07 v13.99,32.07
  Bottom 0.203: v14.44,43.17 14.44,41.44 13.76,40.76 JP1.2 | v13.99,32.07 14.82,32.91 14.82,35.15 14.42,35.55 14.42,37.89 13.84,38.47 13.84,38.73
NEO_PIX1  (1 unrouted)
  Top 0.305: 18.12,21.45 U$1.5
NEO_PIX2  (via drill 0.35)
  Top 0.203: v29.46,28.31 29.46,27.17 29.17,26.88 29.17,22.91 29.88,22.2 29.93,22.2 U$1.10 | v29.05,34.18 23.12,34.18 22.54,34.77 21.1,34.77 20.74,35.12 14.44,35.12 v14.22,34.9 13.49,34.9 JP2.1
  Bottom 0.203: JP1.1 12.76,38.16 13.07,37.84 13.81,37.84 14.01,37.64 14.01,35.11 v14.22,34.9 | v29.05,34.18 29.05,33.62 29.09,33.58 29.09,28.68 v29.46,28.31
NOUT_01  (1 unrouted)
  Top 0.203: P1.4 21.9,33.18 20.34,34.74 15.51,34.74 13.84,33.07 13.84,33.06 12.26,33.06
POT1  (via drill 0.35)
  Top 0.203: v16.55,37.84 16.81,38.09 18.37,38.09 18.83,38.55 25.4,38.55 v25.62,38.78
  Bottom 0.203: POT1.2 16.73,38.01 v16.55,37.84 | v25.62,38.78 25.62,36.67 U$1.17/A3
POT2  (via drill 0.35)
  Top 0.203: v27.53,5 27.71,5 27.88,4.82 30.85,4.82 v31.44,5.4
  Bottom 0.203: POT2.2 27.53,3.77 v27.53,5 | U$1.15/A1 31.16,36.21 31.16,22.44 31.79,21.81 31.79,5.75 v31.44,5.4
SCL0  (via drill 0.35)
  Top 0.203: v28.17,35.28 27.87,35.58 21.63,35.58 U$1.19/A5 | R11.1 24.21,26.76 U2.2 v26.47,27.39 26.5,27.39 27.48,28.36 27.68,28.36 v27.73,28.31 | v14.21,20.94 13.96,20.69 VMEL2.5 | v14.22,26.16 16.08,26.16 16.1,26.13 18.41,26.13 v18.67,25.88
  Bottom 0.203: v28.17,35.28 28.17,33.42 | 28.17,33.42 28.17,33.13 P1.7 | v27.73,28.31 27.73,32.98 28.17,33.42 | v26.47,27.39 26.24,27.62 VMEL1.5 20.43,27.62 20.23,27.42 20.23,26.3 19.81,25.88 v18.67,25.88 | v14.21,20.94 14.21,26.15
  Bottom 0.305: 14.21,26.15 v14.22,26.16
SDA0  (via drill 0.35, 0.38)
  Top 0.203: 24.03,30.59 24.06,30.61 R10.1 24.15,30.78 v26.08,30.78 | 24.03,30.59 23.54,30.09 23.54,29.28 U2.3 | v17.87,27.61 17.87,29.3 v18.15,29.58 | v24.78,29.36 24.78,29.84 24.03,30.59 | VMEL2.2 13.97,16.9 14.58,16.29 v14.65,16.29 | v17.44,25.51 18.18,25.51 18.41,25.27 20.04,25.27 v21.59,23.72
  Bottom 0.203: U$1.18/A4 23.13,36.18 P1.6 26.08,33.13 v26.08,30.78 | VMEL1.2 17.89,27.62 | 17.89,27.62 v17.87,27.61 | v18.15,29.58 24.55,29.58 v24.78,29.36 | v14.65,16.29 20.01,16.29 20.56,16.84 20.56,17.37 20.19,17.74 19.81,17.74 19.59,17.96 19.59,20.95 19.57,20.96 19.57,23.15 20.09,23.67 21.2,23.67 21.25,23.72 v21.59,23.72 | v17.44,25.51 17.89,25.97 17.89,27.62
SOL1  (via drill 0.35, 0.38)  (1 unrouted)
  Top 0.203: U$1.3 11.82,20.24 v11.02,20.24 | v11.67,16.38 13.02,16.38 13.15,16.25 13.2,16.25 v13.99,15.46
  Bottom 0.203: 14.04,15.51 16.32,15.51 16.83,15 16.83,14.45 R1.1 | v11.02,20.24 10.97,20.19 10.97,17.08 v11.67,16.38
SOL2
  Top 0.203: U$1.7 23.13,23.31 R4.1
VEML_INT1  (via drill 0.35)
  Top 0.203: v17.01,27.75 11.07,27.75 v11.04,27.73
  Bottom 0.203: v17.01,27.75 17.53,28.27 VMEL1.3 | v11.04,27.73 11.04,22 U$1.2
VEML_INT2  (via drill 0.35)
  Top 0.203: VMEL2.3 14.61,17.56 14.3,17.87 13.45,17.87 12.67,18.64 v11.59,18.64 | v7.87,23.62 v11.65,23.62
  Bottom 0.203: v11.59,18.64 11.63,18.68 11.63,23.62 v11.65,23.62 | U$1.1 7.89,23.59 v7.87,23.62

### Text on the board
tNames: Neo_pix2 | Neo_out | Explorator Mini v1.1 / 2021 | 12V / GND
bNames: GND | HV | Neo_pix2 | Neo_out | HV | GND